# Altium schematic sheet HDMI.SchDoc
size C; SheetNumber: 6; SheetTotal: 9
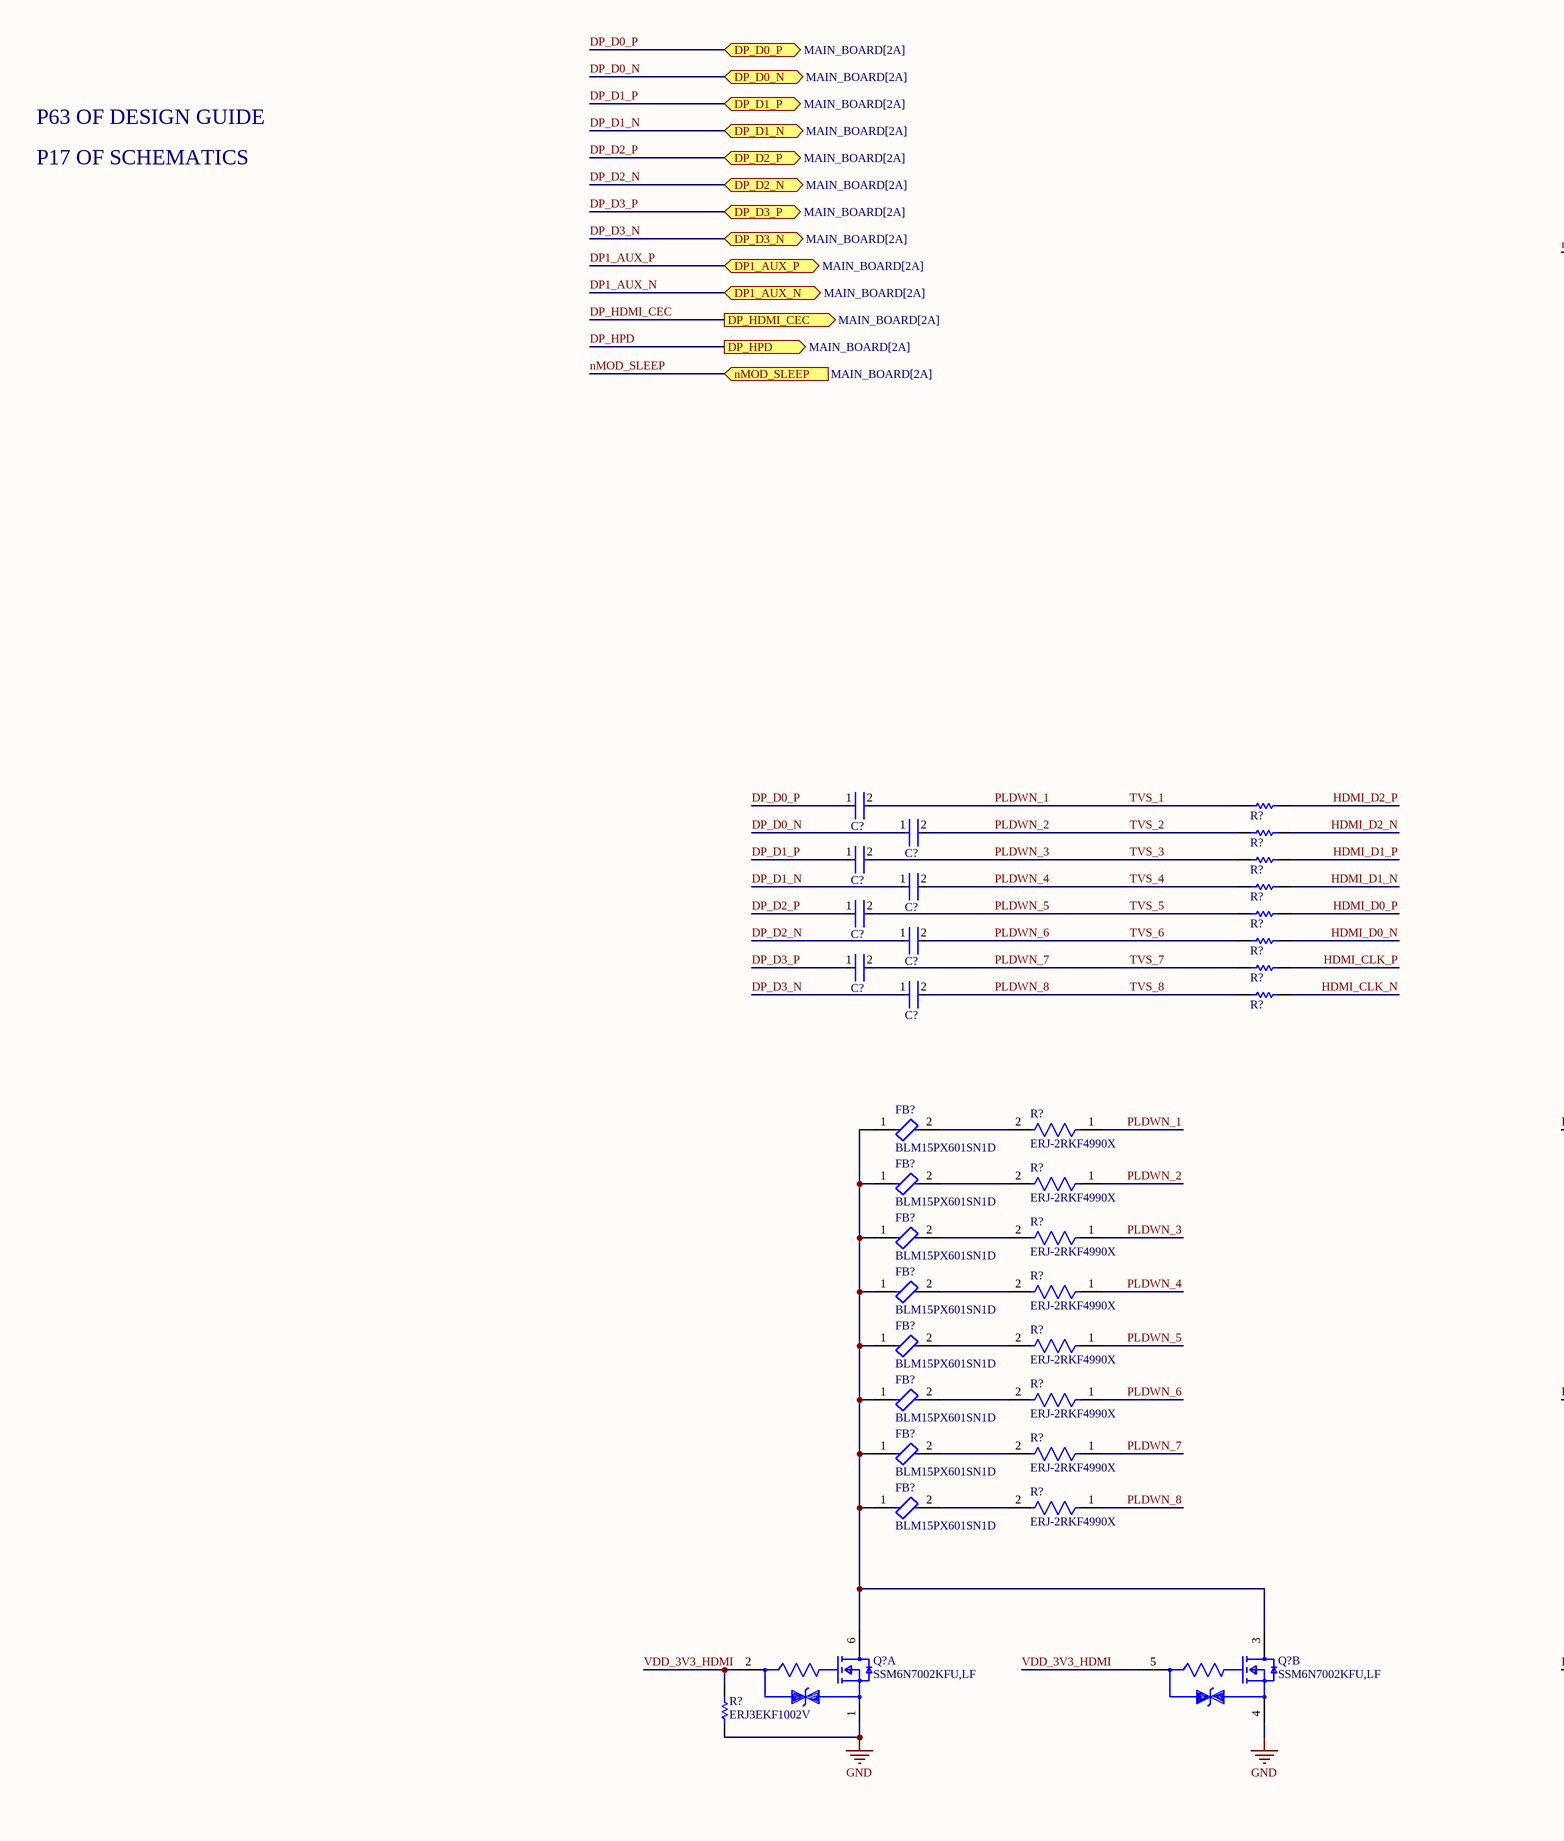
[diagram p0: HDMI.SchDoc, left]
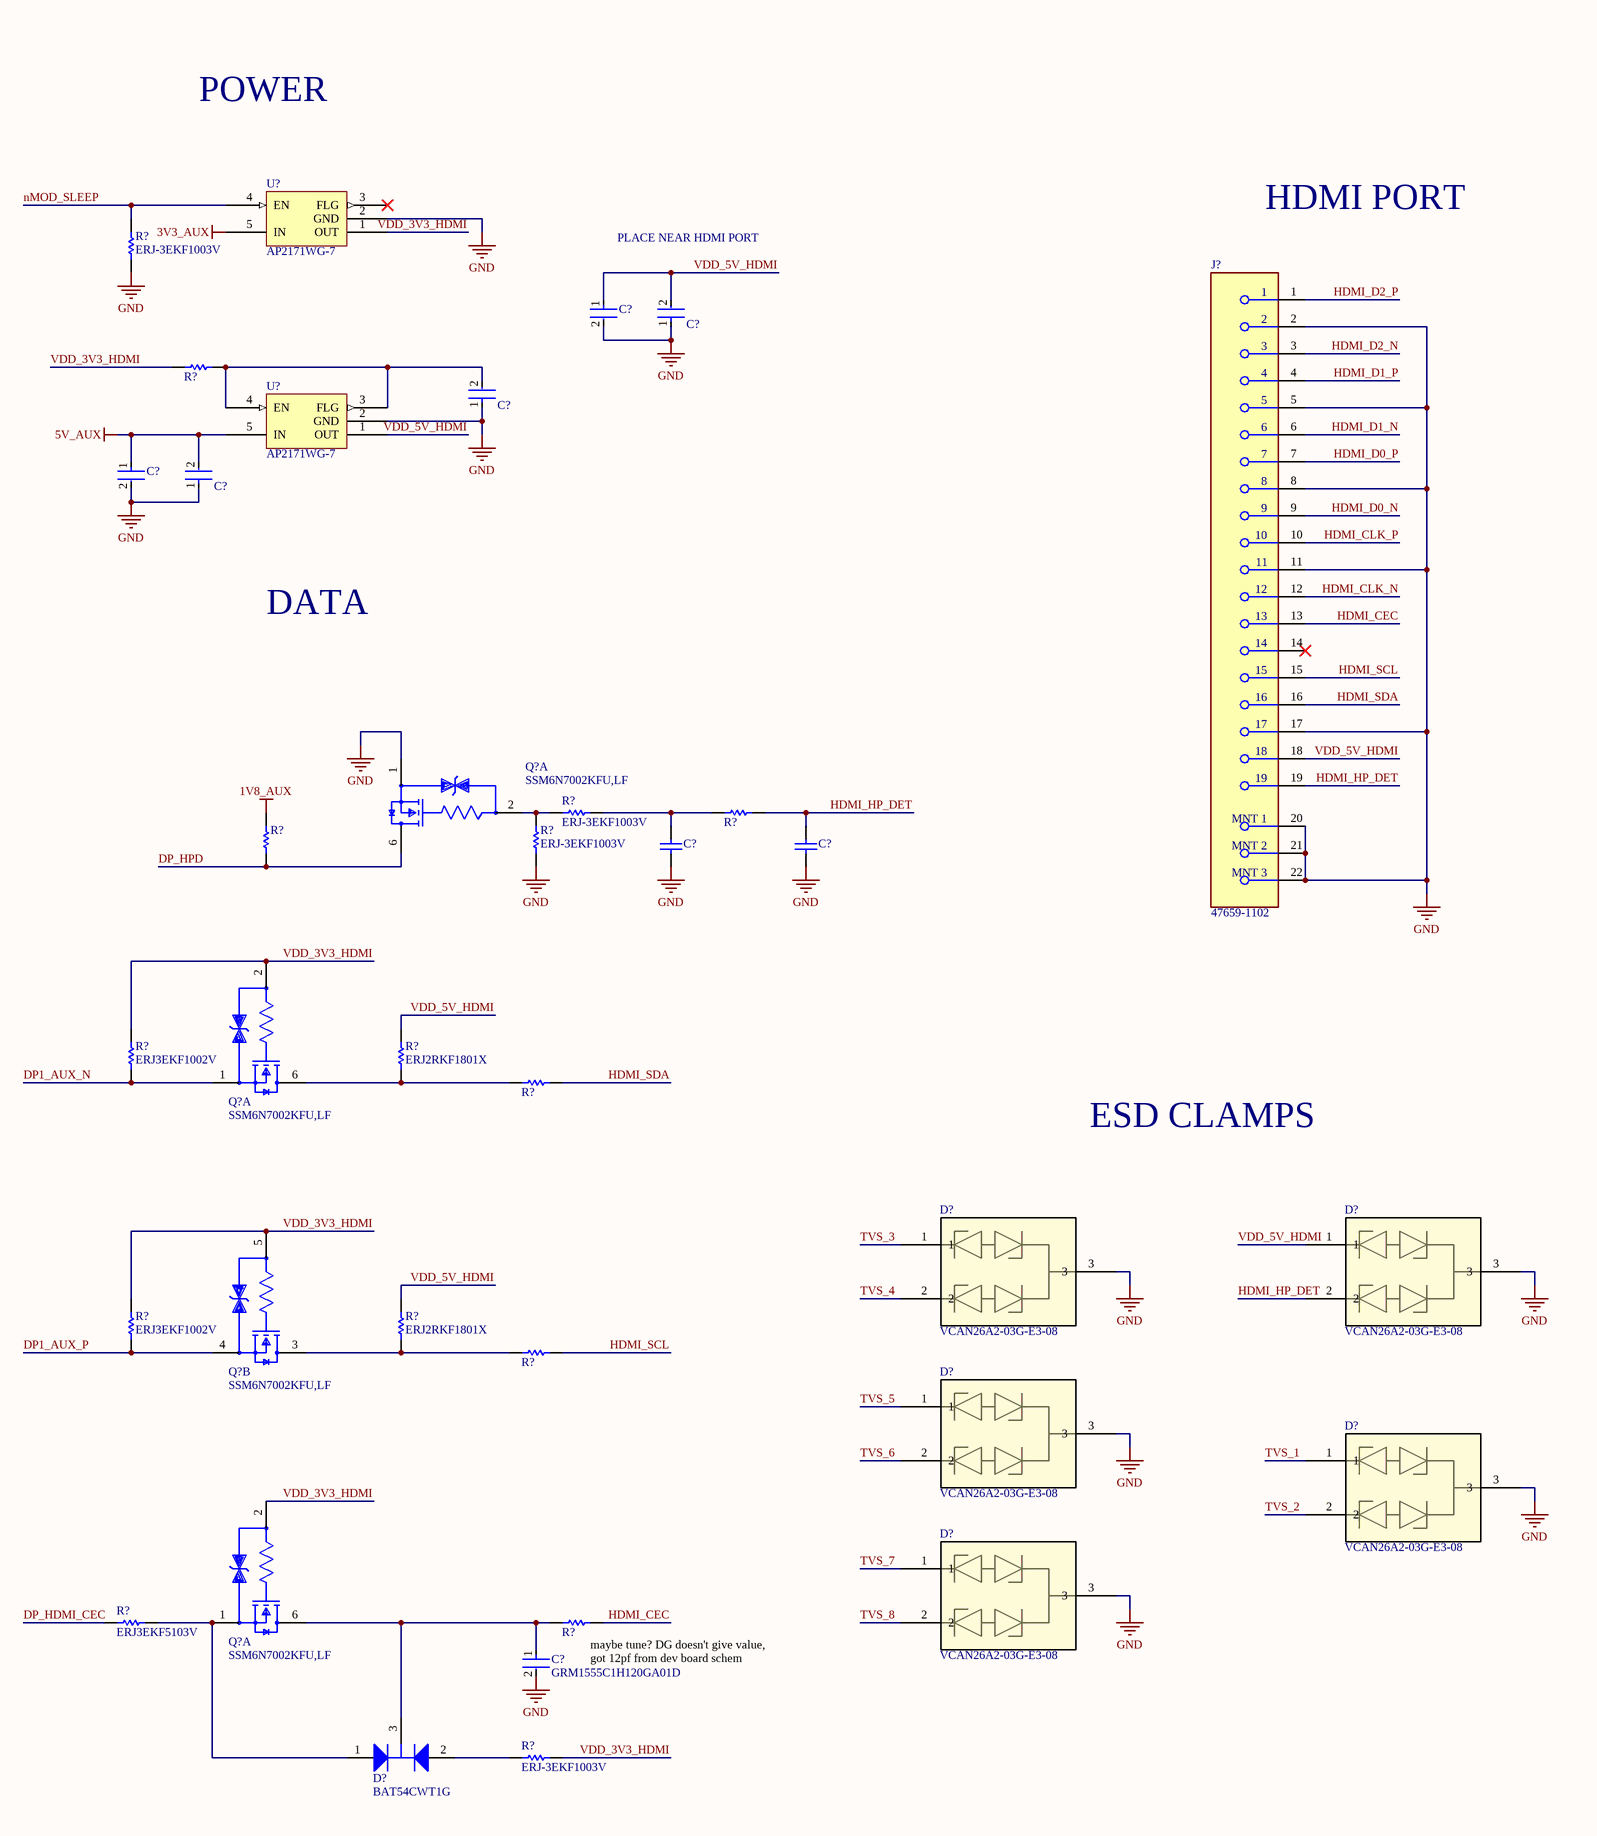
[diagram p1: HDMI.SchDoc, right]

## Parts
(Parts that share a designator on the sheet are numbered #1, #2 ... from top to bottom, then left to right.)
C?#1  GRM188R60J106ME47D  [FP-GRM188-0_1-e0_2_0_55-IPC_A]  (value not drawn)
C?#2  C1005X7R1H104K050BB  [FP-C1005-050-0_05-IPC_C]  (value not drawn)
C?#3  C1005X7R1H104K050BB  [FP-C1005-050-0_05-IPC_C]  (value not drawn)
C?#4  GRM188R60J106ME47D  [FP-GRM188-0_1-e0_2_0_55-IPC_A]  (value not drawn)
C?#5  C1005X7R1H104K050BB  [FP-C1005-050-0_05-IPC_C]  (value not drawn)
C?#6  C1005X7R1H104K050BB  [FP-C1005-050-0_05-IPC_C]  (value not drawn)
C?#7  C1005X7R1H104K050BB  [FP-C1005-050-0_05-IPC_C]  (value not drawn)
C?#8  C1005X7R1H104K050BB  [FP-C1005-050-0_05-IPC_C]  (value not drawn)
C?#9  C1005X7R1H104K050BB  [FP-C1005-050-0_05-IPC_C]  (value not drawn)
C?#10  C0402C221K5RAC7867  [CAPC1005X60X30NL05T10]  (value not drawn)
C?#11  C0402C221K5RAC7867  [CAPC1005X60X30NL05T10]  (value not drawn)
C?#12  C1005X7R1H104K050BB  [FP-C1005-050-0_05-IPC_C]  (value not drawn)
C?#13  C1005X7R1H104K050BB  [FP-C1005-050-0_05-IPC_C]  (value not drawn)
C?#14  C1005X7R1H104K050BB  [FP-C1005-050-0_05-IPC_C]  (value not drawn)
C?#15  C1005X7R1H104K050BB  [FP-C1005-050-0_05-IPC_C]  (value not drawn)
C?#16  GRM1555C1H120GA01D  [FP-GRM155-0_05-MFG]
D?#1  VCAN26A2-03G-E3-08  [VCAN26A2-03G-E3-08-Footprint-1]
D?#2  VCAN26A2-03G-E3-08  [VCAN26A2-03G-E3-08-Footprint-1]
D?#3  VCAN26A2-03G-E3-08  [VCAN26A2-03G-E3-08-Footprint-1]
D?#4  VCAN26A2-03G-E3-08  [VCAN26A2-03G-E3-08-Footprint-1]
D?#5  VCAN26A2-03G-E3-08  [VCAN26A2-03G-E3-08-Footprint-1]
D?#6  BAT54CWT1G  [ONSC-SOT-323-3-419-04_V]
FB?#1  BLM15PX601SN1D  [FP-BLM15-0_05-MFG]
FB?#2  BLM15PX601SN1D  [FP-BLM15-0_05-MFG]
FB?#3  BLM15PX601SN1D  [FP-BLM15-0_05-MFG]
FB?#4  BLM15PX601SN1D  [FP-BLM15-0_05-MFG]
FB?#5  BLM15PX601SN1D  [FP-BLM15-0_05-MFG]
FB?#6  BLM15PX601SN1D  [FP-BLM15-0_05-MFG]
FB?#7  BLM15PX601SN1D  [FP-BLM15-0_05-MFG]
FB?#8  BLM15PX601SN1D  [FP-BLM15-0_05-MFG]
J?  47659-1102  [FP-47659-1102-MFG]
Q?#1  SSM6N7002KFU,LF  [FP-SSOP6-P-0_65A-MFG]  (part A of 2)
Q?#2  SSM6N7002KFU,LF  [FP-SSOP6-P-0_65A-MFG]  (part A of 2)
Q?#3  SSM6N7002KFU,LF  [FP-SSOP6-P-0_65A-MFG]  (part B of 2)
Q?#4  SSM6N7002KFU,LF  [FP-SSOP6-P-0_65A-MFG]  (part A of 2)
Q?#5  SSM6N7002KFU,LF  [FP-SSOP6-P-0_65A-MFG]  (part A of 2)
Q?#6  SSM6N7002KFU,LF  [FP-SSOP6-P-0_65A-MFG]  (part B of 2)
R?#1  ERJ-3EKF1003V  [RESC1608X55X30ML15T15]
R?#2  ERJ3EKF1002V  [RESC1609X55X30LL15T15]  (value not drawn)
R?#3  0402 JUMPER 0 OHM  [RESC1005X40X25NL05T05]  (value not drawn)
R?#4  0402 JUMPER 0 OHM  [RESC1005X40X25NL05T05]  (value not drawn)
R?#5  0402 JUMPER 0 OHM  [RESC1005X40X25NL05T05]  (value not drawn)
R?#6  ERJ-3EKF1003V  [RESC1608X55X30ML15T15]
R?#7  0402 JUMPER 0 OHM  [RESC1005X40X25NL05T05]  (value not drawn)
R?#8  0402 JUMPER 0 OHM  [RESC1005X40X25NL05T05]  (value not drawn)
R?#9  0402 JUMPER 0 OHM  [RESC1005X40X25NL05T05]  (value not drawn)
R?#10  ERJ3EKF1002V  [RESC1609X55X30LL15T15]  (value not drawn)
R?#11  ERJ-3EKF1003V  [RESC1608X55X30ML15T15]
R?#12  0402 JUMPER 0 OHM  [RESC1005X40X25NL05T05]  (value not drawn)
R?#13  0402 JUMPER 0 OHM  [RESC1005X40X25NL05T05]  (value not drawn)
R?#14  0402 JUMPER 0 OHM  [RESC1005X40X25NL05T05]  (value not drawn)
R?#15  ERJ3EKF1002V  [RESC1609X55X30LL15T15]
R?#16  ERJ2RKF1801X  [RESC1005X40X25LL05T05]
R?#17  0402 JUMPER 0 OHM  [RESC1005X40X25NL05T05]  (value not drawn)
R?#18  ERJ-2RKF4990X  [FP-ERJ2RK-MFG]
R?#19  ERJ-2RKF4990X  [FP-ERJ2RK-MFG]
R?#20  ERJ-2RKF4990X  [FP-ERJ2RK-MFG]
R?#21  ERJ-2RKF4990X  [FP-ERJ2RK-MFG]
R?#22  ERJ-2RKF4990X  [FP-ERJ2RK-MFG]
R?#23  ERJ3EKF1002V  [RESC1609X55X30LL15T15]
R?#24  ERJ2RKF1801X  [RESC1005X40X25LL05T05]
R?#25  0402 JUMPER 0 OHM  [RESC1005X40X25NL05T05]  (value not drawn)
R?#26  ERJ-2RKF4990X  [FP-ERJ2RK-MFG]
R?#27  ERJ-2RKF4990X  [FP-ERJ2RK-MFG]
R?#28  ERJ-2RKF4990X  [FP-ERJ2RK-MFG]
R?#29  ERJ3EKF5103V  [RESC1608X55X30LL15T15]
R?#30  0402 JUMPER 0 OHM  [RESC1005X40X25NL05T05]  (value not drawn)
R?#31  ERJ3EKF1002V  [RESC1609X55X30LL15T15]
R?#32  ERJ-3EKF1003V  [RESC1608X55X30ML15T15]
U?#1  AP2171WG-7  [SOT95P285X130-5N]
U?#2  AP2171WG-7  [SOT95P285X130-5N]

## Ports
DP1_AUX_N (bidir, see MAIN_BOARD[2A]), DP1_AUX_P (bidir, see MAIN_BOARD[2A]), DP_D0_N (bidir, see MAIN_BOARD[2A]), DP_D0_P (bidir, see MAIN_BOARD[2A]), DP_D1_N (bidir, see MAIN_BOARD[2A]), DP_D1_P (bidir, see MAIN_BOARD[2A]), DP_D2_N (bidir, see MAIN_BOARD[2A]), DP_D2_P (bidir, see MAIN_BOARD[2A]), DP_D3_N (bidir, see MAIN_BOARD[2A]), DP_D3_P (bidir, see MAIN_BOARD[2A]), DP_HDMI_CEC (out, see MAIN_BOARD[2A]), DP_HPD (out, see MAIN_BOARD[2A]), nMOD_SLEEP (in, see MAIN_BOARD[2A])

## Nets
1V8_AUX: R?#10.2
3V3_AUX: U?#1.5(IN)
5V_AUX: C?#4.1 C?#5.2 U?#2.5(IN)
GND: C?#1.2 C?#2.1 C?#3.1 C?#4.2 C?#5.1 C?#10.1 C?#11.1 C?#16.2 D?#1.3 D?#2.3 D?#3.3 D?#4.3 D?#5.3 J?.2 J?.5 J?.8 J?.11 J?.17 J?.20(MNT_1) J?.21(MNT_2) J?.22(MNT_3) Q?#1.1(Source1) Q?#5.1(Source1) Q?#6.4(Source2) R?#1.1 R?#11.1 R?#31.1 U?#1.2(GND) U?#2.2(GND)
DP1_AUX_N: Q?#2.1(Source1) R?#15.1 ; port DP1_AUX_N
DP1_AUX_P: Q?#3.4(Source2) R?#23.1 ; port DP1_AUX_P
DP_D0_N: C?#7.1 ; port DP_D0_N
DP_D0_P: C?#6.1 ; port DP_D0_P
DP_D1_N: C?#9.1 ; port DP_D1_N
DP_D1_P: C?#8.1 ; port DP_D1_P
DP_D2_N: C?#13.1 ; port DP_D2_N
DP_D2_P: C?#12.1 ; port DP_D2_P
DP_D3_N: C?#15.1 ; port DP_D3_N
DP_D3_P: C?#14.1 ; port DP_D3_P
DP_HDMI_CEC: R?#29.1 ; port DP_HDMI_CEC
DP_HPD: Q?#1.6(Drain1) R?#10.1 ; port DP_HPD
HDMI_CEC: J?.13 R?#30.2
HDMI_CLK_N: J?.12 R?#14.2
HDMI_CLK_P: J?.10 R?#13.2
HDMI_D0_N: J?.9 R?#12.2
HDMI_D0_P: J?.7 R?#9.2
HDMI_D1_N: J?.6 R?#8.2
HDMI_D1_P: J?.4 R?#5.2
HDMI_D2_N: J?.3 R?#4.2
HDMI_D2_P: J?.1 R?#3.2
HDMI_HP_DET: C?#11.2 D?#2.2 J?.19 R?#7.2
HDMI_SCL: J?.15 R?#25.2
HDMI_SDA: J?.16 R?#17.2
nMOD_SLEEP: R?#1.2 U?#1.4(EN) ; port nMOD_SLEEP
PLDWN_1: C?#6.2 D?#4.1 R?#3.1 R?#18.1  [also labelled TVS_1]
PLDWN_2: C?#7.2 D?#4.2 R?#4.1 R?#19.1  [also labelled TVS_2]
PLDWN_3: C?#8.2 D?#1.1 R?#5.1 R?#20.1  [also labelled TVS_3]
PLDWN_4: C?#9.2 D?#1.2 R?#8.1 R?#21.1  [also labelled TVS_4]
PLDWN_5: C?#12.2 D?#3.1 R?#9.1 R?#22.1  [also labelled TVS_5]
PLDWN_6: C?#13.2 D?#3.2 R?#12.1 R?#26.1  [also labelled TVS_6]
PLDWN_7: C?#14.2 D?#5.1 R?#13.1 R?#27.1  [also labelled TVS_7]
PLDWN_8: C?#15.2 D?#5.2 R?#14.1 R?#28.1  [also labelled TVS_8]
VDD_3V3_HDMI: Q?#2.2(Gate1) Q?#3.5(Gate2) Q?#4.2(Gate1) Q?#5.2(Gate1) Q?#6.5(Gate2) R?#2.2 R?#15.2 R?#23.2 R?#31.2 R?#32.2 U?#1.1(OUT)
VDD_5V_HDMI: C?#1.1 C?#2.2 D?#2.1 J?.18 R?#16.2 R?#24.2 U?#2.1(OUT)
NetC?#3_2: C?#3.2 R?#2.1 U?#2.3(FLG) U?#2.4(EN)
NetC?#10_2: C?#10.2 R?#6.2 R?#7.1
NetC?#16_1: C?#16.1 D?#6.3(K) Q?#4.6(Drain1) R?#30.1
NetD?#6_1: D?#6.1(A1) Q?#4.1(Source1) R?#29.2
NetD?#6_2: D?#6.2(A2) R?#32.1
NetFB?#1_1: FB?#1.1 FB?#2.1 FB?#3.1 FB?#4.1 FB?#5.1 FB?#6.1 FB?#7.1 FB?#8.1 Q?#5.6(Drain1) Q?#6.3(Drain2)
NetFB?#1_2: FB?#1.2 R?#18.2
NetFB?#2_2: FB?#2.2 R?#19.2
NetFB?#3_2: FB?#3.2 R?#20.2
NetFB?#4_2: FB?#4.2 R?#21.2
NetFB?#5_2: FB?#5.2 R?#22.2
NetFB?#6_2: FB?#6.2 R?#26.2
NetFB?#7_2: FB?#7.2 R?#27.2
NetFB?#8_2: FB?#8.2 R?#28.2
NetQ?#1_2: Q?#1.2(Gate1) R?#6.1 R?#11.2
NetQ?#2_6: Q?#2.6(Drain1) R?#16.1 R?#17.1
NetQ?#3_3: Q?#3.3(Drain2) R?#24.1 R?#25.1

Not connected (* = marked no-connect by the designer): J? 14*; U?#1 3(FLG)*

## Notes on the sheet
- P63 OF DESIGN GUIDE
- P17 OF SCHEMATICS
- POWER
- HDMI PORT
- PLACE NEAR HDMI PORT
- DATA
- ESD CLAMPS
- (near R?#30) maybe tune? DG doesn't give value, got 12pf from dev board schem

## Library data of the parts
C?#1 C?#4 = CMP-2006-02792-2: Chip Multilayer Ceramic Capacitors for General Purpose, 0603, 10uF, X5R, 15%, 20%, 6.3V; Packaging: Tape and Reel; Voltage Rating (DC): 6.3V; Width: 0.031inch; Termination: SMD/SMT; Dielectric: X5R; Package Quantity: 4000; Voltage Rating: 6.3V; Capacitance: 10uF; Case/Package: 0603; Min Operating Temperature: -55°C; Voltage: 6.3V; Length: 1.6mm; Thickness: 0.035inch; Lead Free: Lead Free; Depth: 0.8mm; Case Code (Imperial): 0603; Max Operating Temperature: 85°C; Material: Ceramic; Height: 0.8mm; Tolerance: 20%; Mount: Surface Mount; REACH SVHC: No SVHC; Radiation Hardening: No; Case Code (Metric): 1608
C?#2 C?#3 C?#5-C?#9 C?#12-C?#15 = CMP-2000-05393-2: Multilayer Ceramic Capacitors 100nF ±10% 50V X7R SMD 0402; Voltage: 50V; Dielectric Material: Ceramic; Min Operating Temperature: -55°C; Depth: 0.5mm; Radiation Hardening: No; RoHS Compliant: Yes; Voltage Rating (DC): 50V; Lead Free: Lead Free; Resistor Type: Ceramic; Height: 0.5mm; Dielectric: X7R; Thickness: 0.022inch; Case/Package: 0402; Case Code (Metric): 1005; Termination: SMD/SMT; Capacitance: 100nF; Packaging: Tape and Reel; Max Operating Temperature: 125°C; Mount: Surface Mount; Package Quantity: 1; Width: 0.02inch; Weight: 2.3E-05oz; Voltage Rating: 50V; Tolerance: 10%; Construction: Flat; Case Code (Imperial): 0402; Length: 1mm; REACH SVHC: No SVHC; Series: C
C?#10 C?#11 = CMP-2008-03137-2: Manufacturer: Kemet; Part Number: C0402C221K5RAC7867
C?#16 = CMP-2008-03945-2: CAP CER 12PF 50V C0G/NP0 0402; Tolerance: 2%; Dielectric: C0G; Material: Ceramic; Termination: SMD/SMT; Mount: Surface Mount; REACH SVHC: No SVHC; Depth: 0.5mm; Case Code (Metric): 1005; Voltage Rating: 50V; Height: 0.5mm; Voltage Rating (DC): 50V; Case Code (Imperial): 0402; Package Quantity: 10000; Construction: Flat; Thickness: 0.022inch; Length: 1mm; Min Operating Temperature: -55°C; Width: 0.5mm; Lead Free: Lead Free; Capacitance: 12pF; Case/Package: 0402; Packaging: Tape and Reel; Series: GRM; Voltage: 50V; Radiation Hardening: No; Max Operating Temperature: 125°C
D?#1-D?#5 = CMP-004-00042-1: ESD Suppressor Diode TVS Bi-Dir 26.5V 3-Pin SOT-323 T/R
D?#6 = CMP-1055-00557-1: Dual Series Cathode Schottky Barrier Diodes, 3-Pin SOT-323, Pb-Free, Tape and Reel; Manufacturer: On Semiconductor; Configuration: Common Cathode; IFSM Max (A): 0.6; trr Max (ns): 5; ComponentLink2Description: Datasheet; Packing: Tape and Reel; ComponentLink3Description: Package Specification; Mounting Technology: Surface Mount; PartNumber: BAT54CWT1G; PackageVersion: Rev. N, 11/2008; RoHS: TRUE; ComponentLink3URL: http://www.onsemi.com/pub_link/Collateral/419-04.PDF; ComponentLink2URL: http://www.onsemi.cn/pub_link/Collateral/BAT54CWT1-D.PDF; PackageReference: SOT-323-3-419-04; ComponentLink1URL: http://www.onsemi.com/; ComponentLink1Description: Manufacturer URL; DatasheetVersion: Rev. 7; PackageDescription: 3-Pin Small Outline Transistor, Body 2 x 1.25 mm, Pitch 0.65 mm
FB?#1-FB?#8 = CMP-0686-00252-4: Chip Ferrite Bead, 0402, 600Ω @ 100MHz, 0.23Ω, 25%, 900mA; Number of Circuits: 1; Impedance: 600R; DC Resistance (DCR): 230mR; Material: Steel; Length: 1mm; Package Quantity: 10000; Height: 0.5mm; Width: 0.5mm; Max DC Current: 900mA; Number of Lines: 1; Termination: SMD/SMT; Packaging: Tape and Reel; Lead Free: Lead Free; Min Operating Temperature: -55°C; Max Operating Temperature: 125°C; Max Current Rating: 900mA; Case Code (Imperial): 0402; Number of Pins: 2; Current Rating: 900mA; Test Frequency: 100MHz; Case/Package: 0402; Tolerance: 25%; Case Code (Metric): 1005
J? = CMP-04768-000010-1: HDMI REC.VERTICAL SMT TYPE W/HEI; RoHS Compliant: Yes
Q?#1-Q?#6 = CMP-35916-000009-1: MOSFET 2N-CH 60V 0.3A; Input Capacitance: 40pF; Continuous Drain Current (ID): 300mA; Max Power Dissipation: 285mW; FET Type: 2 N-Channel; Rds On Max: 1.5R; Mount: Surface Mount; Drain to Source Voltage (Vdss): 60V; Packaging: Tape and Reel
R?#1 R?#6 R?#11 R?#32 = CMP-2000-00182-1: Manufacturer: Panasonic; Part Number: ERJ-3EKF1003V
R?#2 R?#10 R?#15 R?#23 R?#31 = CMP-1012-00623-3: Chip Resistor, 10 KOhm, +/- 1%, 0.1 W, -55 to 155 degC, 0603 (1608 Metric), RoHS, Tape and Reel; Manufacturer: Panasonic; Voltage Rating: 75V; Case\/Package: 0603; Power Rating: 100mW; Resistance: 10KOhm; Temperature Coefficient: 100ppm\/degreesC; Number of Pins: 2; Package Reference: 603; Depth: 0.8mm; Mount: SurfaceMount; Package Description: 2-Pin Surface Mount Device, Body 1.6 x 0.85 mm; Datasheet Version: 02/2017; Length: 1.6mm; Lead Free: LeadFree; Height: 0.45mm; Number of Terminations: 2; Max Power Dissipation: 100mW; Min Operating Temperature: -55degC; Datasheet URL: https://industrial.panasonic.com/cdbs/www-data/pdf/RDA0000/AOA0000C304.pdf; Termination: SMD/SMT; Case Code (Metric): 1608; Case Code (Imperial): 0603; Tolerance: 1%; Max Operating Temperature: 155degC; RoHSCompliant: true; Voltage Rating (DC): 75V; Radiation Hardening: No; Packaging: TapeandReel; Composition: ThickFilm; Mounting Technology: SurfaceMount; Manufacturer URL: http://www.panasonic.com/; Width: 0.031inch; REACH SVHC: NoSVHC; Contact Plating: Tin; Military Standard: Not; Package Quantity: 1
R?#3-R?#5 R?#7-R?#9 R?#12-R?#14 R?#17 R?#25 R?#30 = CMP-009-00206-2: READ THE NAME
R?#16 R?#24 = CMP-2002-01128-1: Manufacturer: Panasonic; Part Number: ERJ2RKF1801X
R?#18-R?#22 R?#26-R?#28 = CMP-2002-00965-2: RES SMD 499 OHM 1% 1/10W 0402; Temperature Coefficient: 100ppm/°C; Max Power Dissipation: 100mW; Voltage Rating (DC): 50V; Resistance: 499R; Technology: THICK FILM; Min Operating Temperature: -55°C; Package Quantity: 1; Width: 0.02inch; Contact Plating: Tin; Tolerance: 1%; Features: Automotive AEC-Q200; Resistance Tolerance: 1%; Size Code: 0402; Military Standard: Not; Resistor Type: Thick Film; Case/Package: 0402; Mount: Surface Mount; Case Code (Metric): 1005; RoHS Compliant: Yes; REACH SVHC: No SVHC; Number of Terminations: 2; Construction: Rectangular; Packaging: Tape and Reel; Series: ERJ; Lead Free: Lead Free; Length: 1mm; Voltage Rating: 50V; Termination: SMD/SMT; Max Operating Temperature: 155°C; Case Code (Imperial): 0402; Height: 0.35mm; Power Rating: 100mW; Depth: 0.5mm
R?#29 = CMP-2000-00542-1: Manufacturer: Panasonic; Part Number: ERJ3EKF5103V
U?#1 U?#2 = CMP-019-00057-1: IC PWR SW USB 1CH 1A SOT-25-5